# Altium schematic sheet Cell Monitor 8S LHS V0.1.SchDoc
size A4; SheetNumber: 4; SheetTotal: 9
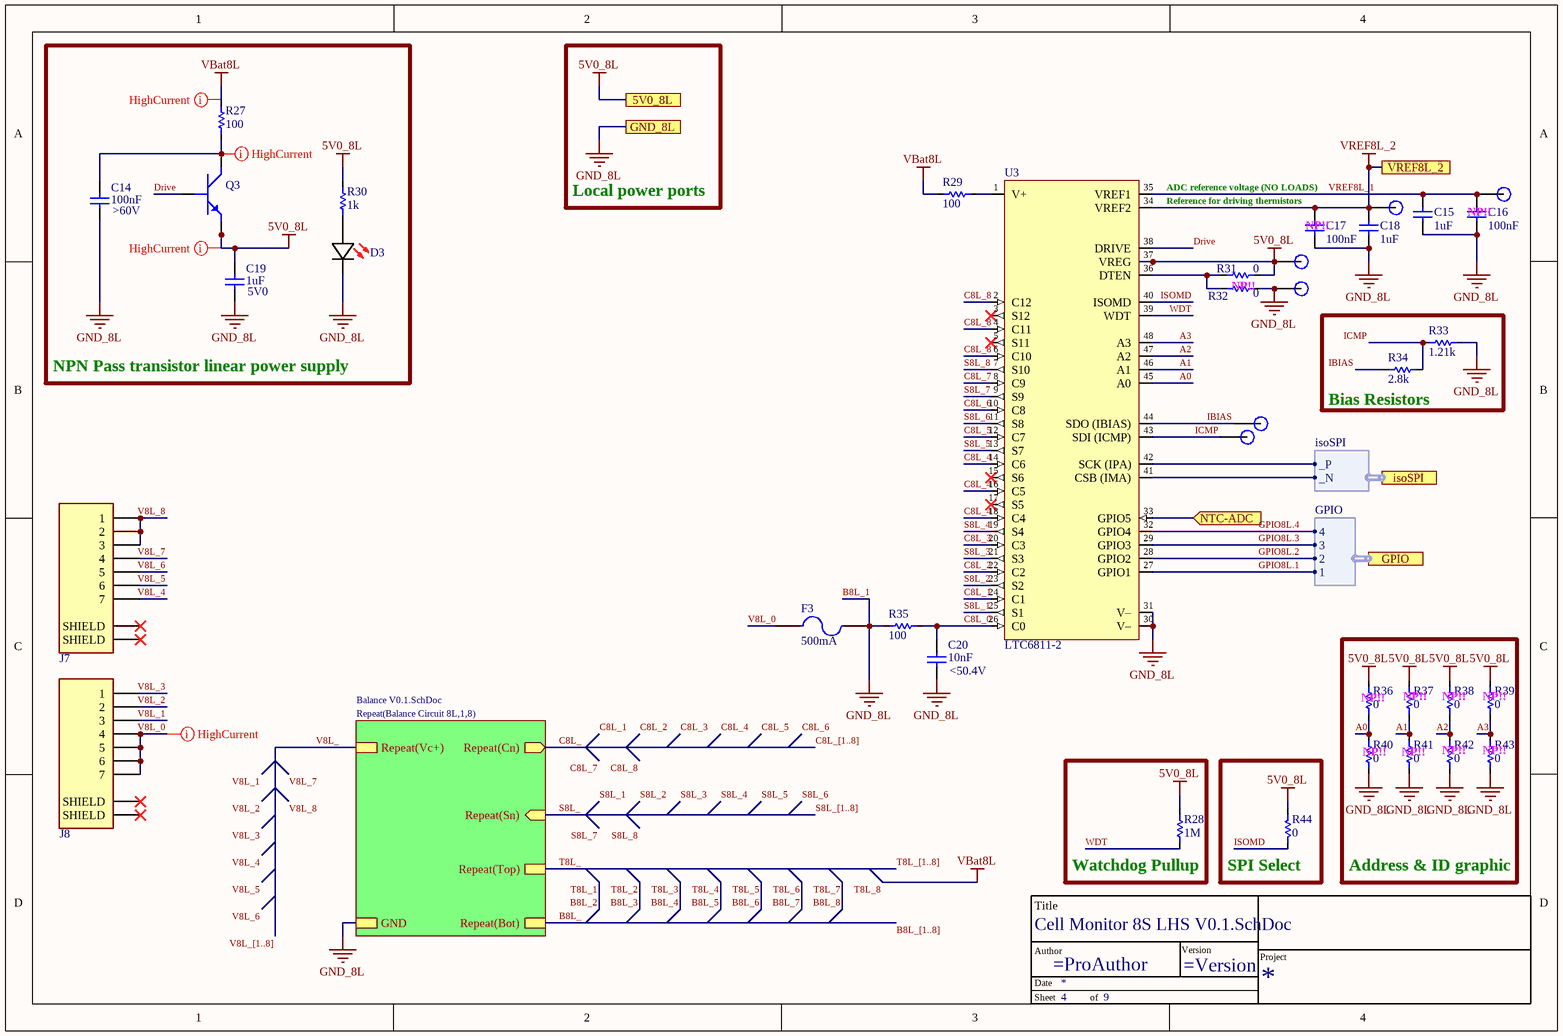
[diagram p0: Cell Monitor 8S LHS V0.1.SchDoc]

## Parts
*?  TitleBlock  (value not drawn)  (graphical)
C14  value 100nF  Voltage: >60V  [C_0402]  (hidden comment: GRM155R62A104KE14D)
C15  value 1uF  [C_0402]  (hidden comment: EMK105BJ105KV-F)
C16  value 100nF  [C_0402]  (hidden comment: GRM155R62A104KE14D)
C17  value 100nF  [C_0402]  (hidden comment: GRM155R62A104KE14D)
C18  value 1uF  [C_0402]  (hidden comment: EMK105BJ105KV-F)
C19  value 1uF  Voltage: 5V0  [C_0402]  (hidden comment: EMK105BJ105KV-F)
C20  value 10nF  Voltage: <50.4V  [C_0402]  (hidden comment: C1005X7S2A103K050BB)
D3  150060SS55040  [LED (0603)]  (value not drawn)
F3  Current Rating: 500mA  [0466.500NR]  (hidden comment: 0466.500NR)
J7  84953-7  [84953-7]  (value not drawn)
J8  84953-7  [84953-7]  (value not drawn)
NT3  NetTie  [NetTie]  (value not drawn)  (net tie, no BOM)
NT4  NetTie  [NetTie]  (value not drawn)  (net tie, no BOM)
Q3  PHPT60603NYX  [LFPAK56 (SOT669)]  (value not drawn)
R27  value 100  [R_2010]  (hidden comment: CRM2010-FX-1000ELF)
R28  value 1M  [R_0402]  (hidden comment: RC0402JR-071ML)
R29  value 100  [R_2010]  (hidden comment: CRM2010-FX-1000ELF)
R30  value 1k  [R_0402]  (hidden comment: RC0402FR-071KL)
R31  value 0  [R_0402]  (hidden comment: CR0402-J/-000GLF)
R32  value 0  [R_0402]  (hidden comment: CR0402-J/-000GLF)
R33  value 1.21k  [R_0402]  (hidden comment: CR0402-FX-1211GLF)
R34  value 2.8k  [R_0402]  (hidden comment: ERJ-2RKF2801X)
R35  value 100  [R_0402]  (hidden comment: RC0402FR-07100RL)
R36  value 0  [R_0402]  (hidden comment: CR0402-J/-000GLF)
R37  value 0  [R_0402]  (hidden comment: CR0402-J/-000GLF)
R38  value 0  [R_0402]  (hidden comment: CR0402-J/-000GLF)
R39  value 0  [R_0402]  (hidden comment: CR0402-J/-000GLF)
R40  value 0  [R_0402]  (hidden comment: CR0402-J/-000GLF)
R41  value 0  [R_0402]  (hidden comment: CR0402-J/-000GLF)
R42  value 0  [R_0402]  (hidden comment: CR0402-J/-000GLF)
R43  value 0  [R_0402]  (hidden comment: CR0402-J/-000GLF)
R44  value 0  [R_0402]  (hidden comment: CR0402-J/-000GLF)
TP8  VREF1  [Test Point]  (value not drawn)  (no BOM)
TP9  VREF2  [Test Point]  (value not drawn)  (no BOM)
TP10  5V0_8SL  [Test Point]  (value not drawn)  (no BOM)
TP11  IBIAS  [Test Point]  (value not drawn)  (no BOM)
TP12  ICMP  [Test Point]  (value not drawn)  (no BOM)
TP14  5V0_8R  [Test Point]  (value not drawn)  (no BOM)
U3  LTC6811-2  [SSOP50P780X200-48N]

## Blocks framed on the sheet
NPN Pass transistor linear power supply: C14 C19 D3 Q3 R27 R30
Bias Resistors: R33 R34
Address & ID graphic: R36-R43
Watchdog Pullup: R28
SPI Select: R44

## Sub-sheets
Repeat(Balance Circuit 8L,1,8) = Balance V0.1.SchDoc: Repeat(Bot), Repeat(Vc+), Repeat(Top), Repeat(Cn) (out), Repeat(Sn) (in), GND

## Ports
5V0_8L, GND_8L, GPIO (harness GPIO), isoSPI (harness isoSPI), NTC-ADC (in), VREF8L_2

## Harnesses
GPIO: 1, 2, 3, 4
isoSPI: _P, _N

## Nets
5V0_8L: C19.2 Q3.1(Emitter) Q3.2(Emitter) Q3.3(Emitter) R28.2 R30.2 R31.2 R36.2 R37.2 R38.2 R39.2 R44.2 TP10.1 U3.37(VREG) ; port 5V0_8L
GND_8L: C14.1 C15.1 C16.1 C17.1 C18.1 C19.1 C20.1 D3.1(K) F3.2 NT3.1 R32.1 R33.2 R35.1 R40.1 R41.1 R42.1 R43.1 TP14.1 U3.30(V–) U3.31(V–) ; port GND_8L, sheet Repeat(Balance Circuit 8L,1,8)/GND
VBat8L: NT4.2 R27.2 R29.2
VREF8L_2: C17.2 C18.2 TP9.1 U3.34(VREF2) ; port VREF8L_2
A0: R36.1 R40.2 U3.45(A0)
A1: R37.1 R41.2 U3.46(A1)
A2: R38.1 R42.2 U3.47(A2)
A3: R39.1 R43.2 U3.48(A3)
B8L_: sheet Repeat(Balance Circuit 8L,1,8)/Repeat(Bot)
B8L_1: NT3.2
C8L_: sheet Repeat(Balance Circuit 8L,1,8)/Repeat(Cn)
C8L_0: C20.2 R35.2 U3.26(C0)
C8L_1: U3.24(C1)
C8L_2: U3.22(C2)
C8L_3: U3.20(C3)
C8L_4: U3.14(C6) U3.16(C5) U3.18(C4)
C8L_5: U3.12(C7)
C8L_6: U3.10(C8)
C8L_7: U3.8(C9)
C8L_8: U3.2(C12) U3.4(C11) U3.6(C10)
Drive: Q3.4(Base) U3.38(DRIVE)
GPIO8L.1: U3.27(GPIO1) ; port GPIO.1
GPIO8L.2: U3.28(GPIO2) ; port GPIO.2
GPIO8L.3: U3.29(GPIO3) ; port GPIO.3
GPIO8L.4: U3.32(GPIO4) ; port GPIO.4
IBIAS: R34.1 TP11.1 U3.44(SDO_(IBIAS))
ICMP: R33.1 R34.2 TP12.1 U3.43(SDI_(ICMP))
ISOMD: R44.1 U3.40(ISOMD)
NTC-ADC: U3.33(GPIO5) ; port NTC-ADC
S8L_: sheet Repeat(Balance Circuit 8L,1,8)/Repeat(Sn)
S8L_1: U3.25(S1)
S8L_2: U3.23(S2)
S8L_3: U3.21(S3)
S8L_4: U3.19(S4)
S8L_5: U3.13(S7)
S8L_6: U3.11(S8)
S8L_7: U3.9(S9)
S8L_8: U3.7(S10)
T8L_: sheet Repeat(Balance Circuit 8L,1,8)/Repeat(Top)
T8L_8: NT4.1
V8L_: sheet Repeat(Balance Circuit 8L,1,8)/Repeat(Vc+)
V8L_0: F3.1 J8.4 J8.5 J8.6 J8.7
V8L_1: J8.3
V8L_2: J8.2
V8L_3: J8.1
V8L_4: J7.7
V8L_5: J7.6
V8L_6: J7.5
V8L_7: J7.4
V8L_8: J7.1 J7.2 J7.3
VREF8L_1: C15.2 C16.2 TP8.1 U3.35(VREF1)
WDT: R28.1 U3.39(WDT)
NetC14_2: C14.2 Q3.5(Collector) R27.1
NetD3_2: D3.2(A) R30.1
NetR29_1: R29.1 U3.1(V+)
NetR31_1: R31.1 R32.2 U3.36(DTEN)
NetU3_41: U3.41(CSB_(IMA)) ; port isoSPI._N
NetU3_42: U3.42(SCK_(IPA)) ; port isoSPI._P

Not connected (* = marked no-connect by the designer): J7 S1(SHIELD)* S2(SHIELD)*; J8 S1(SHIELD)* S2(SHIELD)*; U3 3(S12)* 5(S11)* 15(S6)* 17(S5)*

## Buses and harness runs
bus B8L_[1..8]
bus C8L_[1..8]
bus S8L_[1..8]
bus T8L_[1..8]
bus V8L_[1..8]

## Layout directives
net class HighCurrent; Current: >50mA: 5V0_8L, NetC14_2, V8L_0, VBat8L

## Notes on the sheet
- Local power ports
- ADC reference voltage (NO LOADS)
- (near C17) Reference for driving thermistors
- (near C17) NP!!
- (near C16) NP!!
- (near R32) NP!!
- (near R36) NP!!
- (near R37) NP!!
- (near R38) NP!!
- (near R39) NP!!
- (near R40) NP!!
- (near R41) NP!!
- (near R42) NP!!
- (near R43) NP!!
- Labels drawn without touching a wire or pin: C8L_1, C8L_2, C8L_3, C8L_4, C8L_5, C8L_6, C8L_7, C8L_8, S8L_1, S8L_2, S8L_3, S8L_4, S8L_5, S8L_6, S8L_7, S8L_8, V8L_1, V8L_2, V8L_3, V8L_4, V8L_5, V8L_6, V8L_7, V8L_8
- (in symbol TitleBlock) Title; Author; Version; Project; Date; Sheet; of

## Library data of the parts
C14-C20 = Capacitor: ComponentLink1Description: New link; ComponentLink1URL: *
  C14 C16 C17: Manufacture Part Number 1: GRM155R62A104KE14D
D3 = 150060SS55040: LED RED DIFFUSED 0603 SMD; Manufacturer: Wurth Electronics; Lens Style: Flat; Luminous Intensity: 70mcd; Forward Voltage: 2V; Test Current: 20mA; Viewing Angle: 140°; Dominant Wavelength: 630nm; Lens Size: 0.8mm; Supplier 1: Mouser; Manufacturer Part Number: 150060SS55040; RoHS: No; Category: LEDs; Stock 1: 17006; Pricing 1: 1=0.18000, 10=0.16800, 50=0.16800, 100=0.15200, 1000=0.12100, 10000=0.10600 (USD); Mount: Surface Mount; Case/Package: 0603; Color: Red; Case Code (Imperial): 0603; Case Code (Metric): 1608; Packaging: Tape and Reel; Lens Transparency: Diffused; Length: 1.6mm; Width: 0.8mm; Height: 0.5mm; RoHS Compliant: No; Supplier Part Number 1: 710-150060SS55040
F3 = Fuse 2: LITTELFUSE - 0466.500NR - Fuse, Surface Mount, 500 mA, 466 Series, 63 VAC, 63 VDC, Very Fast Acting, 1206; Body Material: Thermoplastic; Voltage Rating (AC): 63V; Resistance: 350mR; DC Cold Resistance: 248mR; Fuse Type: Board Mount (Cartridge Style Excluded); Approvals: UL,CSA; Published: 8-Jun-2000; LatestRevisionDate: 17-Jul-2002; LatestRevisionNote: Re-released for DXP Platform.; PackageReference: PIN-W2/E2.8; Publisher: Altium Limited; PackageDescription: Thru-Hole; 2 Leads; Supplier 1: Mouser; Supplier Part Number 1: 576-0466.500NR; Manufacturer: Littelfuse; Manufacturer Part Number: 0466.500NR; RoHS: Yes; Category: Fuses; Stock 1: 36497; Pricing 1: 1=0.77000, 10=0.59200, 50=0.59200, 100=0.48900, 1000=0.41600, 10000=0.39000 (USD); Mount: Surface Mount; Case/Package: 1206; Number of Pins: 2; Case Code (Metric): 3216; Case Code (Imperial): 1206; Housing Material: Ceramic; Terminal Material: Copper; Min Operating Temperature: -55°C; Max Operating Temperature: 90°C; Packaging: Tape and Reel; Package Quantity: 5000; Voltage Rating (DC): 63V; Series: 466; Voltage Rating: 63V; Termination: SMD/SMT; Fuse Current: 500mA; Working Voltage: 63V; Length: 3.18mm; Width: 0.06inch; Height: 0.023inch; Depth: 1.52mm; Radiation Hardening: No; RoHS Compliant: Yes; REACH SVHC: Unknown; Lead Free: Lead Free; ComponentLink1URL: https://datasheet.ciiva.com/17081/0466-500nr-17081083.pdf?src-supplier=Allied+Electronics; ComponentLink1Description: https://datasheet.ciiva.com/17081/0466-500nr-17081083.pdf?src-supplier=Allied+Electronics; ComponentLink2URL: https://datasheet.ciiva.com/16327/littelfuse-fuse-466-16327478.pdf?src-supplier=Future+Electronics; ComponentLink2Description: https://datasheet.ciiva.com/16327/littelfuse-fuse-466-16327478.pdf?src-supplier=Future+Electronics; ComponentLink3URL: https://datasheet.ciiva.com/299/466seriesdrawing-299207.pdf?src-supplier=Digi-Key; ComponentLink3Description: https://datasheet.ciiva.com/299/466seriesdrawing-299207.pdf?src-supplier=Digi-Key; ComponentLink4URL: https://datasheet.ciiva.com/299/466seriesdrawing-299208.pdf?src-supplier=Digi-Key; ComponentLink4Description: https://datasheet.ciiva.com/299/466seriesdrawing-299208.pdf?src-supplier=Digi-Key; ComponentLink5URL: https://datasheet.ciiva.com/299/466seriesdrawing-299209.pdf?src-supplier=Digi-Key; ComponentLink5Description: https://datasheet.ciiva.com/299/466seriesdrawing-299209.pdf?src-supplier=Digi-Key; ComponentLink6URL: https://datasheet.ciiva.com/14102/ei466-dat-e-14102891.pdf?src-supplier=Distrelec; ComponentLink6Description: https://datasheet.ciiva.com/14102/ei466-dat-e-14102891.pdf?src-supplier=Distrelec; ComponentLink7URL: https://datasheet.ciiva.com/15186/getdatasheetpartid-57351-15186924.pdf?src-supplier=Verical; ComponentLink7Description: https://datasheet.ciiva.com/15186/getdatasheetpartid-57351-15186924.pdf?src-supplier=Verical
J7 J8 = 84953-7: FPC Connectors, Flex-to-Board, 7 Position, .039 in [1 mm] Centerline, Zero Insertion Force (ZIF), Right Angle, Surface Mount; Manufacturer: TE Connectivity; Current Rating: 1A; Number of Contacts: 7; Shielding: Unshielded; Gender: Female; Voltage Rating: 200V; Connector Type: Receptacle,Connector,Socket; Wire/Cable Type: Flat Flex; Mating Alignment: Yes (With); PCB Mount Alignment: No (Without); PCB Mount Retention: With; Contact Location: Top; Pitch: 0.039inch; Plating Thickness: 2um; Supplier 1: Mouser; Manufacturer Part Number: 84953-7; RoHS: Yes; Category: FFC / FPC; Pricing 1: 1=0.96000, 10=0.78800, 50=0.78800, 100=0.68800, 500=0.59100, 1000=0.52600, 1500=0.47600, 4500=0.45900, 9000=0.43600, 10000=0.43600, 24000=0.42600 (USD); Mount: Surface Mount; Contact Material: Bronze; Contact Plating: Tin,Bright; Housing Color: Natural; Housing Material: Polymer; Min Operating Temperature: -40°C; Max Operating Temperature: 85°C; Termination: SMD/SMT; Package Quantity: 1500; Number of Rows: 1; Packaging: Tape and Reel; Orientation: Right Angle; Number of Positions: 7; Connector System: Flex-to-Board; PCB Mounting Orientation: Right Angle; Sealable: No (Without); Shrouded: Yes (With); Contact Current Rating: 1A; Max Voltage Rating (AC): 200V; Series: FPC; Length: 0.5866inch; Width: 0.2575inch; Height: 2.56mm; Depth: 7.3mm; Radiation Hardening: No; ELV: Compliant; REACH SVHC: Unknown; Flammability Rating: UL94 V-0; RoHS Compliant: Yes; ComponentLink1URL: https://datasheet.ciiva.com/669/eng-cd-84953-a3-669227.pdf?src-supplier=Digi-Key; ComponentLink1Description: https://datasheet.ciiva.com/669/eng-cd-84953-a3-669227.pdf?src-supplier=Digi-Key; ComponentLink2URL: https://datasheet.ciiva.com/669/eng-cd-84953-a3-669228.pdf?src-supplier=Digi-Key; ComponentLink2Description: https://datasheet.ciiva.com/669/eng-cd-84953-a3-669228.pdf?src-supplier=Digi-Key; ComponentLink3URL: https://datasheet.ciiva.com/30243/eng-ds-1-1773440-6-0506-30243340.pdf?src-supplier=Onlinecomponents.com; ComponentLink3Description: https://datasheet.ciiva.com/30243/eng-ds-1-1773440-6-0506-30243340.pdf?src-supplier=Onlinecomponents.com; ComponentLink4URL: https://datasheet.ciiva.com/16659/eng-ds-1-1773440-6-0506-16659033.pdf?src-supplier=Avnet+Europe; ComponentLink4Description: https://datasheet.ciiva.com/16659/eng-ds-1-1773440-6-0506-16659033.pdf?src-supplier=Avnet+Europe; ComponentLink5URL: https://datasheet.ciiva.com/669/eng-cd-84953-a3-669226.pdf?src-supplier=Digi-Key; ComponentLink5Description: https://datasheet.ciiva.com/669/eng-cd-84953-a3-669226.pdf?src-supplier=Digi-Key; ComponentLink6URL: https://datasheet.ciiva.com/15177/getdatasheetpartid-565061-15177031.pdf?src-supplier=Verical; ComponentLink6Description: https://datasheet.ciiva.com/15177/getdatasheetpartid-565061-15177031.pdf?src-supplier=Verical; ComponentLink7URL: https://datasheet.ciiva.com/10034/eng-ds-1-1773440-6-0506-10034350.pdf?src-supplier=Avnet; ComponentLink7Description: https://datasheet.ciiva.com/10034/eng-ds-1-1773440-6-0506-10034350.pdf?src-supplier=Avnet; Supplier Part Number 1: 571-84953-7
Q3 = PHPT60603NYX: 60V, 3 A NPN high power bipolar transistor
R27-R44 = Resistor
TP8-TP12 TP14 = Test Point: 1.2mm Test point
U3 = LTC6811-2: 12 Channel Multicell Battery Monitor with Addressable Interface